# Altium schematic sheet atmega.SchDoc
size A; SheetNumber: 2; SheetTotal: 4
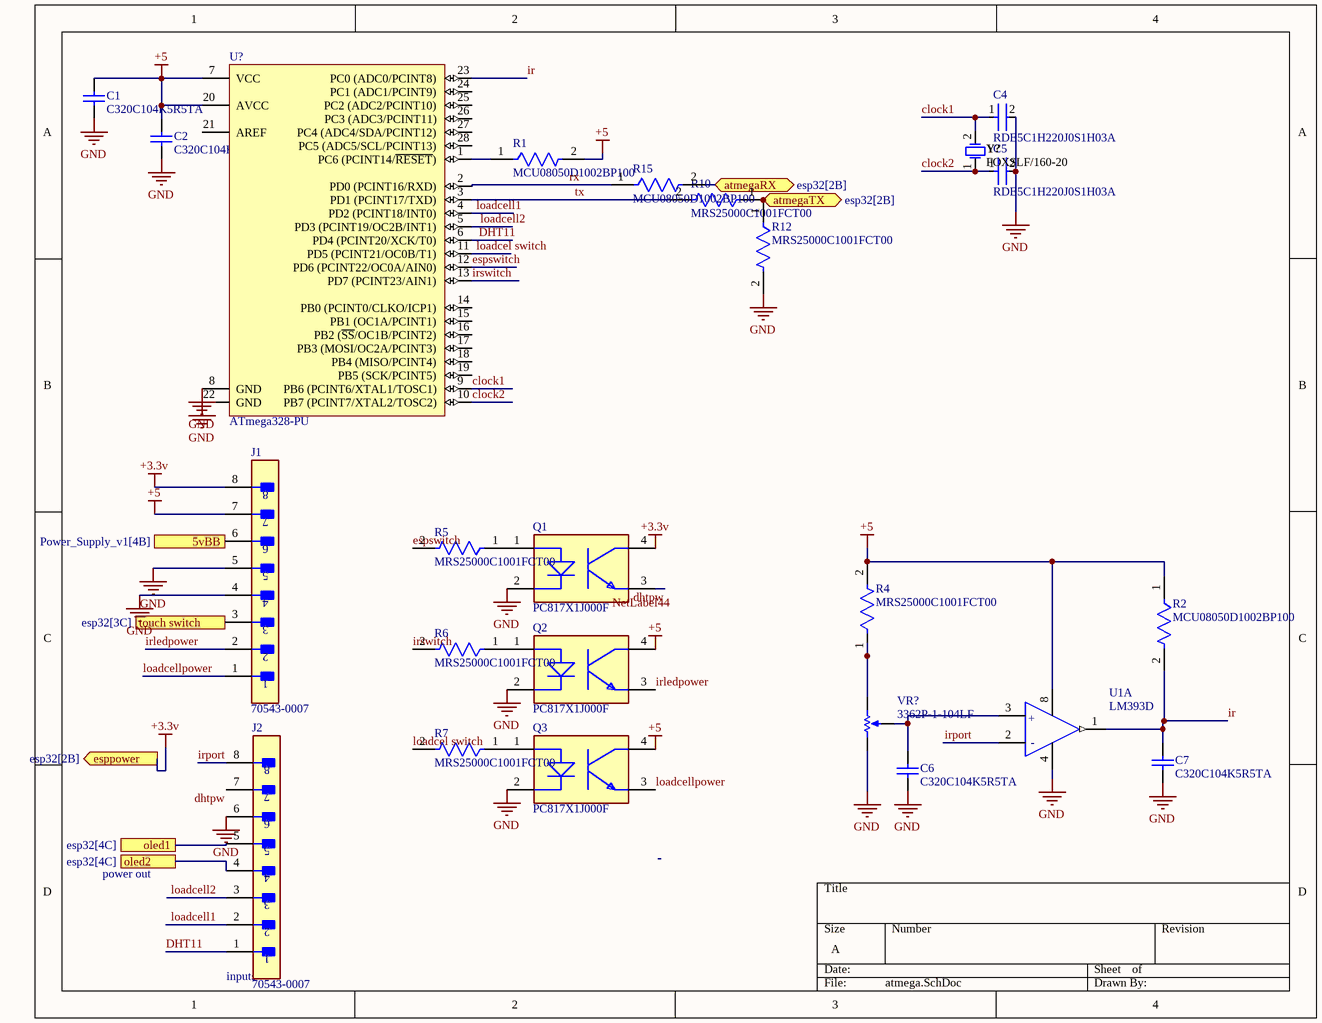
[diagram p0: atmega.SchDoc]

## Parts
C1  C320C104K5R5TA  [CAPR51-254-508X318X736]
C2  C320C104K5R5TA  [CAPR51-254-508X318X736]
C4  RDE5C1H220J0S1H03A  [FP-RDE0P1-MFG]
C5  RDE5C1H220J0S1H03A  [FP-RDE0P1-MFG]
C6  C320C104K5R5TA  [CAPR51-254-508X318X736]
C7  C320C104K5R5TA  [CAPR51-254-508X318X736]
J1  70543-0007  [FP-70543-0007-MFG]
J2  70543-0007  [FP-70543-0007-MFG]
Q1  PC817X1J000F  [FP-PC817X1J000F-MFG]
Q2  PC817X1J000F  [FP-PC817X1J000F-MFG]
Q3  PC817X1J000F  [FP-PC817X1J000F-MFG]
R1  MCU08050D1002BP100  [FP-MCU0805-IPC_C]
R2  MCU08050D1002BP100  [FP-MCU0805-IPC_C]
R4  MRS25000C1001FCT00  [FP-MRS25-MFG]
R5  MRS25000C1001FCT00  [FP-MRS25-MFG]
R6  MRS25000C1001FCT00  [FP-MRS25-MFG]
R7  MRS25000C1001FCT00  [FP-MRS25-MFG]
R10  MRS25000C1001FCT00  [FP-MRS25-MFG]
R12  MRS25000C1001FCT00  [FP-MRS25-MFG]
R15  MCU08050D1002BP100  [FP-MCU0805-IPC_C]
U1  LM393D  [FP-SO8-MFG]  (part A of 2)
U?  ATmega328-PU  [28P3]
VR?  3362P-1-104LF  [BOUR-3362P]
Y?  FOXSLF/160-20  [FOX-FOXSLF160-20]

## Ports
5vBB (see Power_Supply_v1[4B]), atmegaRX (bidir, see esp32[2B]), atmegaTX (bidir, see esp32[2B]), esppower (out, see esp32[2B]), oled1 (see esp32[4C]), oled2 (see esp32[4C]), touch switch (see esp32[3C])

## Nets
+3.3v: J1.8 Q1.4(C) ; port esppower
+5: C1.2 C2.2 J1.7 Q2.4(C) Q3.4(C) R1.2 R2.1 R4.2 U1.8(Vcc+) U?.7(VCC) U?.20(AVCC)
GND: C1.1 C2.1 C4.2 C5.2 C6.1 C7.1 J1.4 J1.5 J2.6 Q1.2(C) Q2.2(C) Q3.2(C) R12.2 U1.4(Vcc-) U?.8(GND) U?.22(GND) VR?.1(CCW)
5vBB: J1.6 ; port 5vBB
atmegaRX: R15.2 ; port atmegaRX
atmegaTX: R10.1 R12.1 ; port atmegaTX
clock1: C4.1 U?.9(PB6_(PCINT6/XTAL1/TOSC1)) Y?.2
clock2: C5.1 U?.10(PB7_(PCINT7/XTAL2/TOSC2)) Y?.1
DHT11: J2.1 U?.6(PD4_(PCINT20/XCK/T0))
dhtpw: J2.7 Q1.3(E)
espswitch: R5.2 U?.12(PD6_(PCINT22/OC0A/AIN0))
ir: C7.2 R2.2 U1.1(Out1) U?.23(PC0_(ADC0/PCINT8))
irledpower: J1.2 Q2.3(E)
irport: J2.8 U1.2(In1-)
irswitch: R6.2 U?.13(PD7_(PCINT23/AIN1))
loadcel switch: R7.2 U?.11(PD5_(PCINT21/OC0B/T1))
loadcell1: J2.2 U?.4(PD2_(PCINT18/INT0))
loadcell2: J2.3 U?.5(PD3_(PCINT19/OC2B/INT1))
loadcellpower: J1.1 Q3.3(E)
oled1: J2.5 ; port oled1
oled2: J2.4 ; port oled2
rx: R15.1 U?.2(PD0_(PCINT16/RXD))
touch switch: J1.3 ; port touch switch
tx: R10.2 U?.3(PD1_(PCINT17/TXD))
NetC6_2: C6.2 U1.3(In1+) VR?.2(S)
NetQ1_1: Q1.1(A) R5.1
NetQ2_1: Q2.1(A) R6.1
NetQ3_1: Q3.1(A) R7.1
NetR1_1: R1.1 U?.1(PC6_(PCINT14/~{RESET}))
NetR4_1: R4.1 VR?.3(CW)

Not connected (* = marked no-connect by the designer): U? 14(PB0_(PCINT0/CLKO/ICP1)) 15(PB1_(OC1A/PCINT1)) 16(PB2_(~{SS}/OC1B/PCINT2)) 17(PB3_(MOSI/OC2A/PCINT3)) 18(PB4_(MISO/PCINT4)) 19(PB5_(SCK/PCINT5)) 21(AREF) 24(PC1_(ADC1/PCINT9)) 25(PC2_(ADC2/PCINT10)) 26(PC3_(ADC3/PCINT11)) 27(PC4_(ADC4/SDA/PCINT12)) 28(PC5_(ADC5/SCL/PCINT13))

## Notes on the sheet
- power out
- (near J2) inputs
- Labels drawn without touching a wire or pin: NetLabel44
- (in symbol CMP-12132-000003-1, part A) +; -

## Library data of the parts
C1 C2 C6 C7 = CMP-1664-00004-1: Radial Leaded Multilayer Ceramic Capacitor, 0.1 uF, +/- 10%, 50 V, -55 to 125 degC, 2-Pin THD, RoHS, Tape and Reel; Case\Package: SOT-23-5; Max Power Dissipation: 250 mW; Output Current: 150 mA; Dropout Voltage: 260 mV; Outputs: 1; Output Voltage: 5 V; Max Input Voltage: 8 V; Min Operating Temperature: -40 degC; Packaging: Tape and Reel; Height: 1.3 mm; Radiation Hardening: No; Pins: 5; ComponentLink1Description: Manufacturer URL; Mount: Surface Mount; RoHSCompliant: true; Max Operating Temperature: 85 degC; PackageReference: CAPR51-254-508X318X736; ComponentLink2URL: http://www.kemet.com/docfinder?Partnumber=C320C104K5R5TA; PackageDescription: 2-Pin Through Hole Device, Body 5.08 x 3.18 mm, Pitch 2.54 mm; ComponentLink1URL: http://www.kemet.com/; Width: 1.8 mm; Package Quantity: 3000; DatasheetVersion: Dec-15; Length: 3 mm; ComponentLink2Description: Datasheet
C4 C5 = CMP-06035-010311-1: Ceramic Capacitor 22pF ±5% 50V C0G Radial; Lead Diameter: 0.5mm; Max Operating Temperature: 125°C; Lead Pitch: 0.098inch; Resistor Type: Ceramic; Case/Package: Radial; Package Quantity: 1; Capacitance: 22pF; Min Operating Temperature: -55°C; Dielectric: C0G; Height: 3.5mm; Voltage Rating (DC): 50V; Length: 0.197inch; Voltage Rating: 50V; Packaging: Tape and Reel; Height - Seated (Max): 0.236inch; Width: 0.098inch; Tolerance: 5%; Termination: Radial; Mount: Through Hole
J1 J2 = CMP-04776-000239-1: CONN HEADER VERT 8POS 2.54MM; Number of Circuits: 8; Gender: Male; Contact Resistance: 30mR; Current Rating: 3A; Glow Wire Compliant: Non-compliant; Approvals: UL; Voltage Rating: 250V; Body Material: Glass; Contact Plating: Gold; Mount: Through Hole; Lead Free: Lead Free; Packaging: Rail/Tube; Number of Positions: 8; Material: Brass; ELV: Compliant; Orientation: Vertical; Pitch: 2.54mm; Series: 70543; Package Quantity: 1104; RoHS Compliant: Yes; Housing Color: Black; Termination: Through Hole; Number of Contacts: 8; Min Operating Temperature: -40°C; Radiation Hardening: No; Max Operating Temperature: 105°C; Voltage Rating (DC): 250V; Flammability Rating: UL94 V-0; Number of Rows: 1; Housing Material: Thermoplastic; Contact Material: Bronze; Color: Black
Q1-Q3 = CMP-65434-000003-1: OPTOISOLATOR 5KV TRANS 4DIP; Collector Emitter Saturation Voltage: 200mV; Forward Voltage: 1.4V; Power Dissipation: 200mW; Input Current: 20mA; Max Collector Current: 50mA; Collector Emitter Breakdown Voltage: 80V; Rise Time: 18000ns; Number of Elements: 1; Reverse Breakdown Voltage: 6V; Current Transfer Ratio: 600%; Min Operating Temperature: -30°C; Number of Pins: 4; Radiation Hardening: No; Output Current per Channel: 50mA; Case/Package: DIP; Fall Time: 18000ns; Forward Current: 50mA; Isolation Voltage: 5kV; Package Quantity: 2000; Max Operating Temperature: 100°C; Packaging: Sleeve; Max Input Current: 50mA; Output Voltage: 80V; Max Power Dissipation: 200mW; Mount: Through Hole; Number of Channels: 1; Collector Emitter Voltage (VCEO): 80V
R1 R2 R15 = CMP-02407-010458-1: RES 1.05K OHM 0.5% 1/5W 0805; Power Rating: 125mW; Voltage Rating (DC): 100V; Tolerance: 0.1%; Resistance: 10kR; Temperature Coefficient: 25ppm/°C; Min Operating Temperature: -55°C; Military Standard: Not; Composition: Thin Film; Max Power Dissipation: 125mW; Lead Free: Lead Free; Case/Package: 0805; Contact Plating: Tin; Depth: 1.25mm; Number of Terminations: 2; Height: 0.022inch; Package Quantity: 1000; Max Operating Temperature: 125°C; Packaging: Tape and Reel; Mount: Surface Mount; Radiation Hardening: No; Length: 2mm; Width: 0.049inch
R4-R7 R10 R12 = CMP-02408-000051-1: RES 1K OHM 0.6W 1% AXIAL; Power Rating: 600mW; Lead Diameter: 0.6mm; Voltage Rating (DC): 350V; Resistance: 1kR; Temperature Coefficient: 50ppm/°C; Width: 2.5mm; Military Standard: Not; Package Quantity: 5000; Radiation Hardening: No; Case/Package: Axial; Resistance Tolerance: 1%; Resistor Type: Metal Film; Contact Plating: Tin; Length: 6.5mm; Lead Free: Lead Free; RoHS Compliant: Yes; Mount: Through Hole; Number of Pins: 2; Technology: THIN FILM; Voltage Rating: 350V; Min Operating Temperature: -55°C; Weight: 0.00776oz; Diameter: 2.5mm; Construction: Cylindrical; Series: MRS25; Tolerance: 1%; Packaging: Tape and Reel; Max Operating Temperature: 155°C; Max Power Dissipation: 600mW; Number of Terminations: 2; Termination: Axial
U1 = CMP-12132-000003-1: IC VOLT COMPARATOR DUAL LP 8SOIC; Manufacturer: STMicroelectronics; Response Time: 1.3us; Min Supply Voltage: 2V; Input Offset Voltage: 1mV; Input Bias Current: 0.02uA; Max Dual Supply Voltage: 18V; Output Current Per Channel: 18mA; Max Junction Temp: +150°C; Standoff Height: 0.1mm; Number Of Channels: 2; Nominal Supply Current: 0.45-0.6mA; Voltage Gain: 200V/mV; Max Supply Voltage: 36V; Min Dual Supply Voltage: 1V; Ambient Temperature Range Low: 0°C; ComponentLink2Description: Datasheet; Lead Free: Yes; Device Class L3: Comparators; Device Class L2: Linear ICs; Manufacturer Part Number: LM393D; Digikey Description: IC VOLT COMPARATOR DUAL LP 8SOIC; Category: IC; Octopart: https://octopart.com/lm393d-stmicroelectronics-25832; Package: SO8; RoHS: TRUE; Footprint Url: https://www.st.com/resource/en/datasheet/stm8l001j3.pdf; Temperature Range Low: 0°C; Temperature Range High: +70°C; Mouser Description: Analog Comparators Lo-Pwr Dual Voltage; ComponentLink2URL: https://www.st.com/resource/en/datasheet/lm393.pdf; Automotive: No; Temperature: 0°C to +70°C; Height: 1.75mm; Device Class L1: Integrated Circuits (ICs); Ambient Temperature Range High: +70°C
U? = CMP-0095-00015-2: 8-bit AVR Microcontroller, 32KB Flash, 1KB EEPROM, 2KB SRAM, 28-pin PDIP, Industrial Grade (-40°C to 85°C); ComponentLink3Description: ATmega48A/48PA/88A/88PA/168A/168PA/328/328P Summary; RevisionNote: DatasheetVersion updated. URLs added.; DatasheetVersion: revD, May-2011; ComponentLink1URL: http://www.atmel.com/; PackageVersion: revB, Sep-2001; PackageDescription: 28-lead (0.300"/7.62mm Wide) Plastic Dual Inline Package (PDIP); PackageReference: 28P3; ComponentLink1Description: Manufacturer URL; ComponentLink2Description: ATmega48A/48PA/88A/88PA/168A/168PA/328/328P Datasheet; ComponentLink3URL: http://www.atmel.com/dyn/resources/prod_documents/8271S.pdf; ComponentLink2URL: http://www.atmel.com/dyn/resources/prod_documents/8271.pdf
VR? = CMP-1747-00003-1: Square Trimpot(R) Trimming Potentiometer, 100 KOhm, 300 V, -55 to 125 degC, 3-Pin THD, RoHS, Tube; Voltage Rating: 250 V; Case\Package: Axial; Tolerance: 1%; Power Rating: 250 mW; Resistance: 1 mohm; RoHSCompliant: true; ComponentLink2URL: http://www.bourns.com/docs/Product-Datasheets/3362.pdf; ComponentLink1Description: Manufacturer URL; DatasheetVersion: May-16; Package Quantity: 200; ComponentLink2Description: Datasheet; Min Operating Temperature: -55 degC; Mount: Through Hole; PackageDescription: 3-Pin Through Hole Device, Body 6.6 x 6.99 mm, Pitch 2.54 mm; Length: 0.248 inch; ComponentLink1URL: http://www.bourns.com/; PackageReference: 3326P; Max Operating Temperature: 155 degC; Packaging: Bulk
Y? = CMP-1749-00003-1: Resistance Weld Thru-Hole Crystal, 16 MHz, -20 to 70 degC, 2-Pin THD, RoHS, Bulk; Voltage Rating: 250 V; Tolerance: 1%; Resistance: 221 kohm; Case\Package: Axial; Power Rating: 250 mW; RoHSCompliant: true; Package Quantity: 200; Packaging: Bulk; Min Operating Temperature: -55 degC; DatasheetVersion: Mar-15; ComponentLink1URL: http://www.foxonline.com/; Max Operating Temperature: 155 degC; PackageReference: FOXSLF160-20; Mount: Through Hole; PackageDescription: 2-Pin Through Hole Device, Body 11.35 x 4.65 mm; ComponentLink1Description: Manufacturer URL; ComponentLink2URL: http://www.foxonline.com/pdfs/hc49slf.pdf; ComponentLink2Description: Datasheet; Length: 0.248 inch